# Altium schematic sheet eMMC.SchDoc: TEBF0808 - eMMC
size A4; Organization: Trenz Electronic GmbH; DocumentNumber: TEBF0808; Revision: 04; SheetNumber: 25; SheetTotal: 36; Date: 2016-09-29; CompanyName: Trenz Electronic GmbH
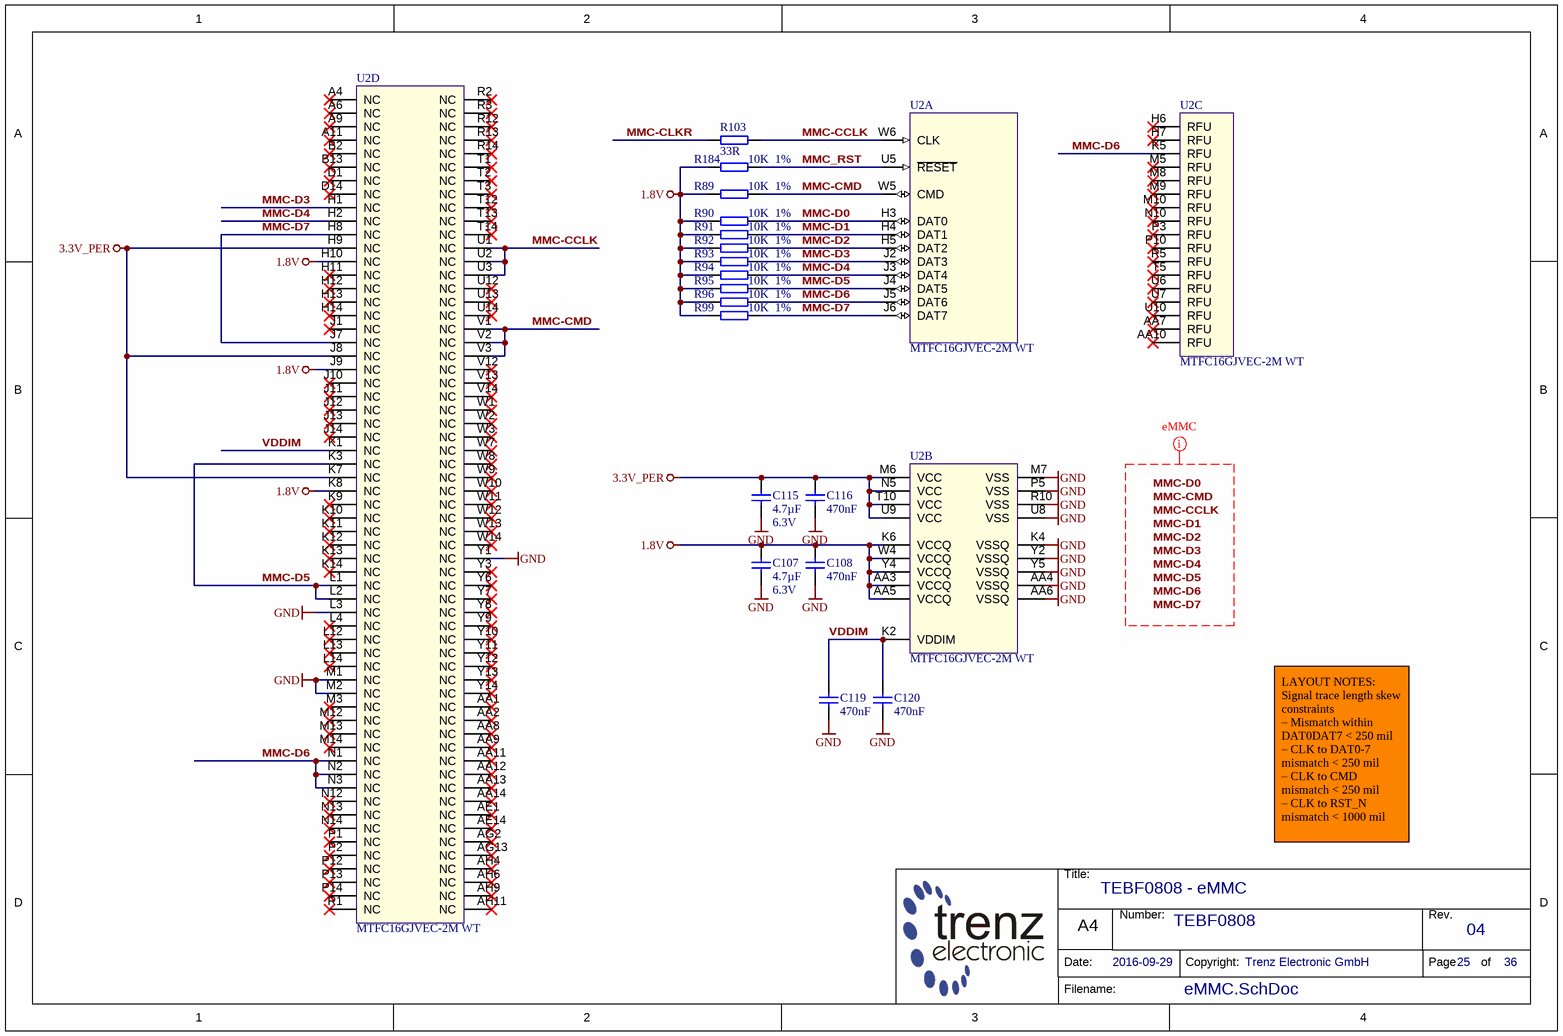
[diagram p0: eMMC.SchDoc]

## Parts
C107  4.7µF  Voltage: 6.3V  [CAPC1005X60N]
C108  470nF  [CAPC1005X55N]
C115  4.7µF  Voltage: 6.3V  [CAPC1005X60N]
C116  470nF  [CAPC1005X55N]
C119  470nF  [CAPC1005X55N]
C120  470nF  [CAPC1005X55N]
R89  10K  Tolerance: 1%  [RESC1005X40N]
R90  10K  Tolerance: 1%  [RESC1005X40N]
R91  10K  Tolerance: 1%  [RESC1005X40N]
R92  10K  Tolerance: 1%  [RESC1005X40N]
R93  10K  Tolerance: 1%  [RESC1005X40N]
R94  10K  Tolerance: 1%  [RESC1005X40N]
R95  10K  Tolerance: 1%  [RESC1005X40N]
R96  10K  Tolerance: 1%  [RESC1005X40N]
R99  10K  Tolerance: 1%  [RESC1005X40N]
R103  33R  [RESC1005X40N]
R184  10K  Tolerance: 1%  [RESC1005X40N]
U2  MTFC16GJVEC-2M WT  [BGA169C50P14X28_1400X1800X80_MICRON]  (parts A,B,C,D of 4)

## Nets
1.8V: C107.1 C108.1 R89.1 R90.1 R91.1 R92.1 R93.1 R94.1 R95.1 R96.1 R99.1 R184.1 U2.AA3(VCCQ) U2.AA5(VCCQ) U2.H10(NC) U2.J9(NC) U2.K6(VCCQ) U2.K8(NC) U2.W4(VCCQ) U2.Y4(VCCQ)
3.3V_PER: C115.1 C116.1 U2.H9(NC) U2.J8(NC) U2.K7(NC) U2.M6(VCC) U2.N5(VCC) U2.T10(VCC) U2.U9(VCC)
GND: C107.2 C108.2 C115.2 C116.2 C119.2 C120.2 U2.AA4(VSSQ) U2.AA6(VSSQ) U2.K4(VSSQ) U2.L3(NC) U2.M1(NC) U2.M2(NC) U2.M7(VSS) U2.P5(VSS) U2.R10(VSS) U2.U8(VSS) U2.Y1(NC) U2.Y2(VSSQ) U2.Y5(VSSQ)
MMC-CCLK: R103.2 U2.U1(NC) U2.U2(NC) U2.U3(NC) U2.W6(CLK)
MMC-CLKR: R103.1
MMC-CMD: R89.2 U2.V1(NC) U2.V2(NC) U2.V3(NC) U2.W5(CMD)
MMC-D0: R90.2 U2.H3(DAT0)
MMC-D1: R91.2 U2.H4(DAT1)
MMC-D2: R92.2 U2.H5(DAT2)
MMC-D3: R93.2 U2.H1(NC) U2.J2(DAT3)
MMC-D4: R94.2 U2.H2(NC) U2.J3(DAT4)
MMC-D5: R95.2 U2.J4(DAT5) U2.K3(NC) U2.L1(NC) U2.L2(NC)
MMC-D6: R96.2 U2.J5(DAT6) U2.K5(RFU) U2.N1(NC) U2.N2(NC) U2.N3(NC)
MMC-D7: R99.2 U2.H8(NC) U2.J6(DAT7) U2.J7(NC)
MMC_RST: R184.2 U2.U5(~{RESET})
VDDIM: C119.1 C120.1 U2.K1(NC) U2.K2(VDDIM)

Not connected (* = marked no-connect by the designer): U2 A4(NC)* A6(NC)* A9(NC)* A11(NC)* AA1(NC)* AA2(NC)* AA7(RFU)* AA8(NC)* AA9(NC)* AA10(RFU)* AA11(NC)* AA12(NC)* AA13(NC)* AA14(NC)* AE1(NC)* AE14(NC)* AG2(NC)* AG13(NC)* AH4(NC)* AH6(NC)* AH9(NC)* AH11(NC)* B2(NC)* B13(NC)* D1(NC)* D14(NC)* H6(RFU)* H7(RFU)* H11(NC)* H12(NC)* H13(NC)* H14(NC)* J1(NC)* J10(NC)* J11(NC)* J12(NC)* J13(NC)* J14(NC)* K9(NC)* K10(NC)* K11(NC)* K12(NC)* K13(NC)* K14(NC)* L4(NC)* L12(NC)* L13(NC)* L14(NC)* M3(NC)* M5(RFU)* M8(RFU)* M9(RFU)* M10(RFU)* M12(NC)* M13(NC)* M14(NC)* N10(RFU)* N12(NC)* N13(NC)* N14(NC)* P1(NC)* P2(NC)* P3(RFU)* P10(RFU)* P12(NC)* P13(NC)* P14(NC)* R1(NC)* R2(NC)* R3(NC)* R5(RFU)* R12(NC)* R13(NC)* R14(NC)* T1(NC)* T2(NC)* T3(NC)* T5(RFU)* T12(NC)* T13(NC)* T14(NC)* U6(RFU)* U7(RFU)* U10(RFU)* U12(NC)* U13(NC)* U14(NC)* V12(NC)* V13(NC)* V14(NC)* W1(NC)* W2(NC)* W3(NC)* W7(NC)* W8(NC)* W9(NC)* W10(NC)* W11(NC)* W12(NC)* W13(NC)* W14(NC)* Y3(NC)* Y6(NC)* Y7(NC)* Y8(NC)* Y9(NC)* Y10(NC)* Y11(NC)* Y12(NC)* Y13(NC)* Y14(NC)*

## Layout directives
net class eMMC: MMC-CCLK, MMC-CMD, MMC-D0, MMC-D1, MMC-D2, MMC-D3, MMC-D4, MMC-D5, MMC-D6, MMC-D7

## Notes on the sheet
- LAYOUT NOTES:
  Signal trace length skew constraints
  – Mismatch within DAT0DAT7 < 250 mil
  – CLK to DAT0-7 mismatch < 250 mil
  – CLK to CMD mismatch < 250 mil
  – CLK to RST_N mismatch < 1000 mil
- Labels drawn without touching a wire or pin: MMC-CCLK, MMC-CMD, MMC-D0, MMC-D1, MMC-D2, MMC-D3, MMC-D4, MMC-D5, MMC-D6, MMC-D7
- Title:
- Number:
- Rev.
- Date:
- A4
- Copyright:
- Page
- of
- Filename:

## Library data of the parts
C107 C115 = 24719: KON 4.7µF 6.3V X5R SMD 20%; AN: 24719; Value: 4.7u; Mixed: SMT; Preferred: Yes; Case: 1005 (0402); Technology: X5R; Tolerance: 20%
C108 C116 C119 C120 = 23659: KON 470nF 6,3V X5R SMD; AN: 23659; Value: 470n; Voltage: 6.3V; Mixed: SMT; Preferred: Yes; Case: 1005 (0402); Technology: X5R
R89-R96 R99 R184 = 22750: WID SMD 10K 1% 0,063W; AN: 22750; Mixed: SMT; Preferred: Yes; Case: 1005 (0402); Value: 10K; Technology: TK100
R103 = 22770: WID SMD 33R 1% 0,063W; AN: 22770; Mixed: SMT; Value: 33; Preferred: Yes; Tolerance: 1%; Case: 1005 (0402); Technology: TK100
U2 = 25015: AN: 25015; Trenz-Stock: Yes; Mixed: SMT; Case: WFBGA169; HelpURL: B:\AD\adlib\datasheet\MTFC; H-ART: MTFC16GJVEC-2M WT